# Altium project APES_Learn.PrjPcb
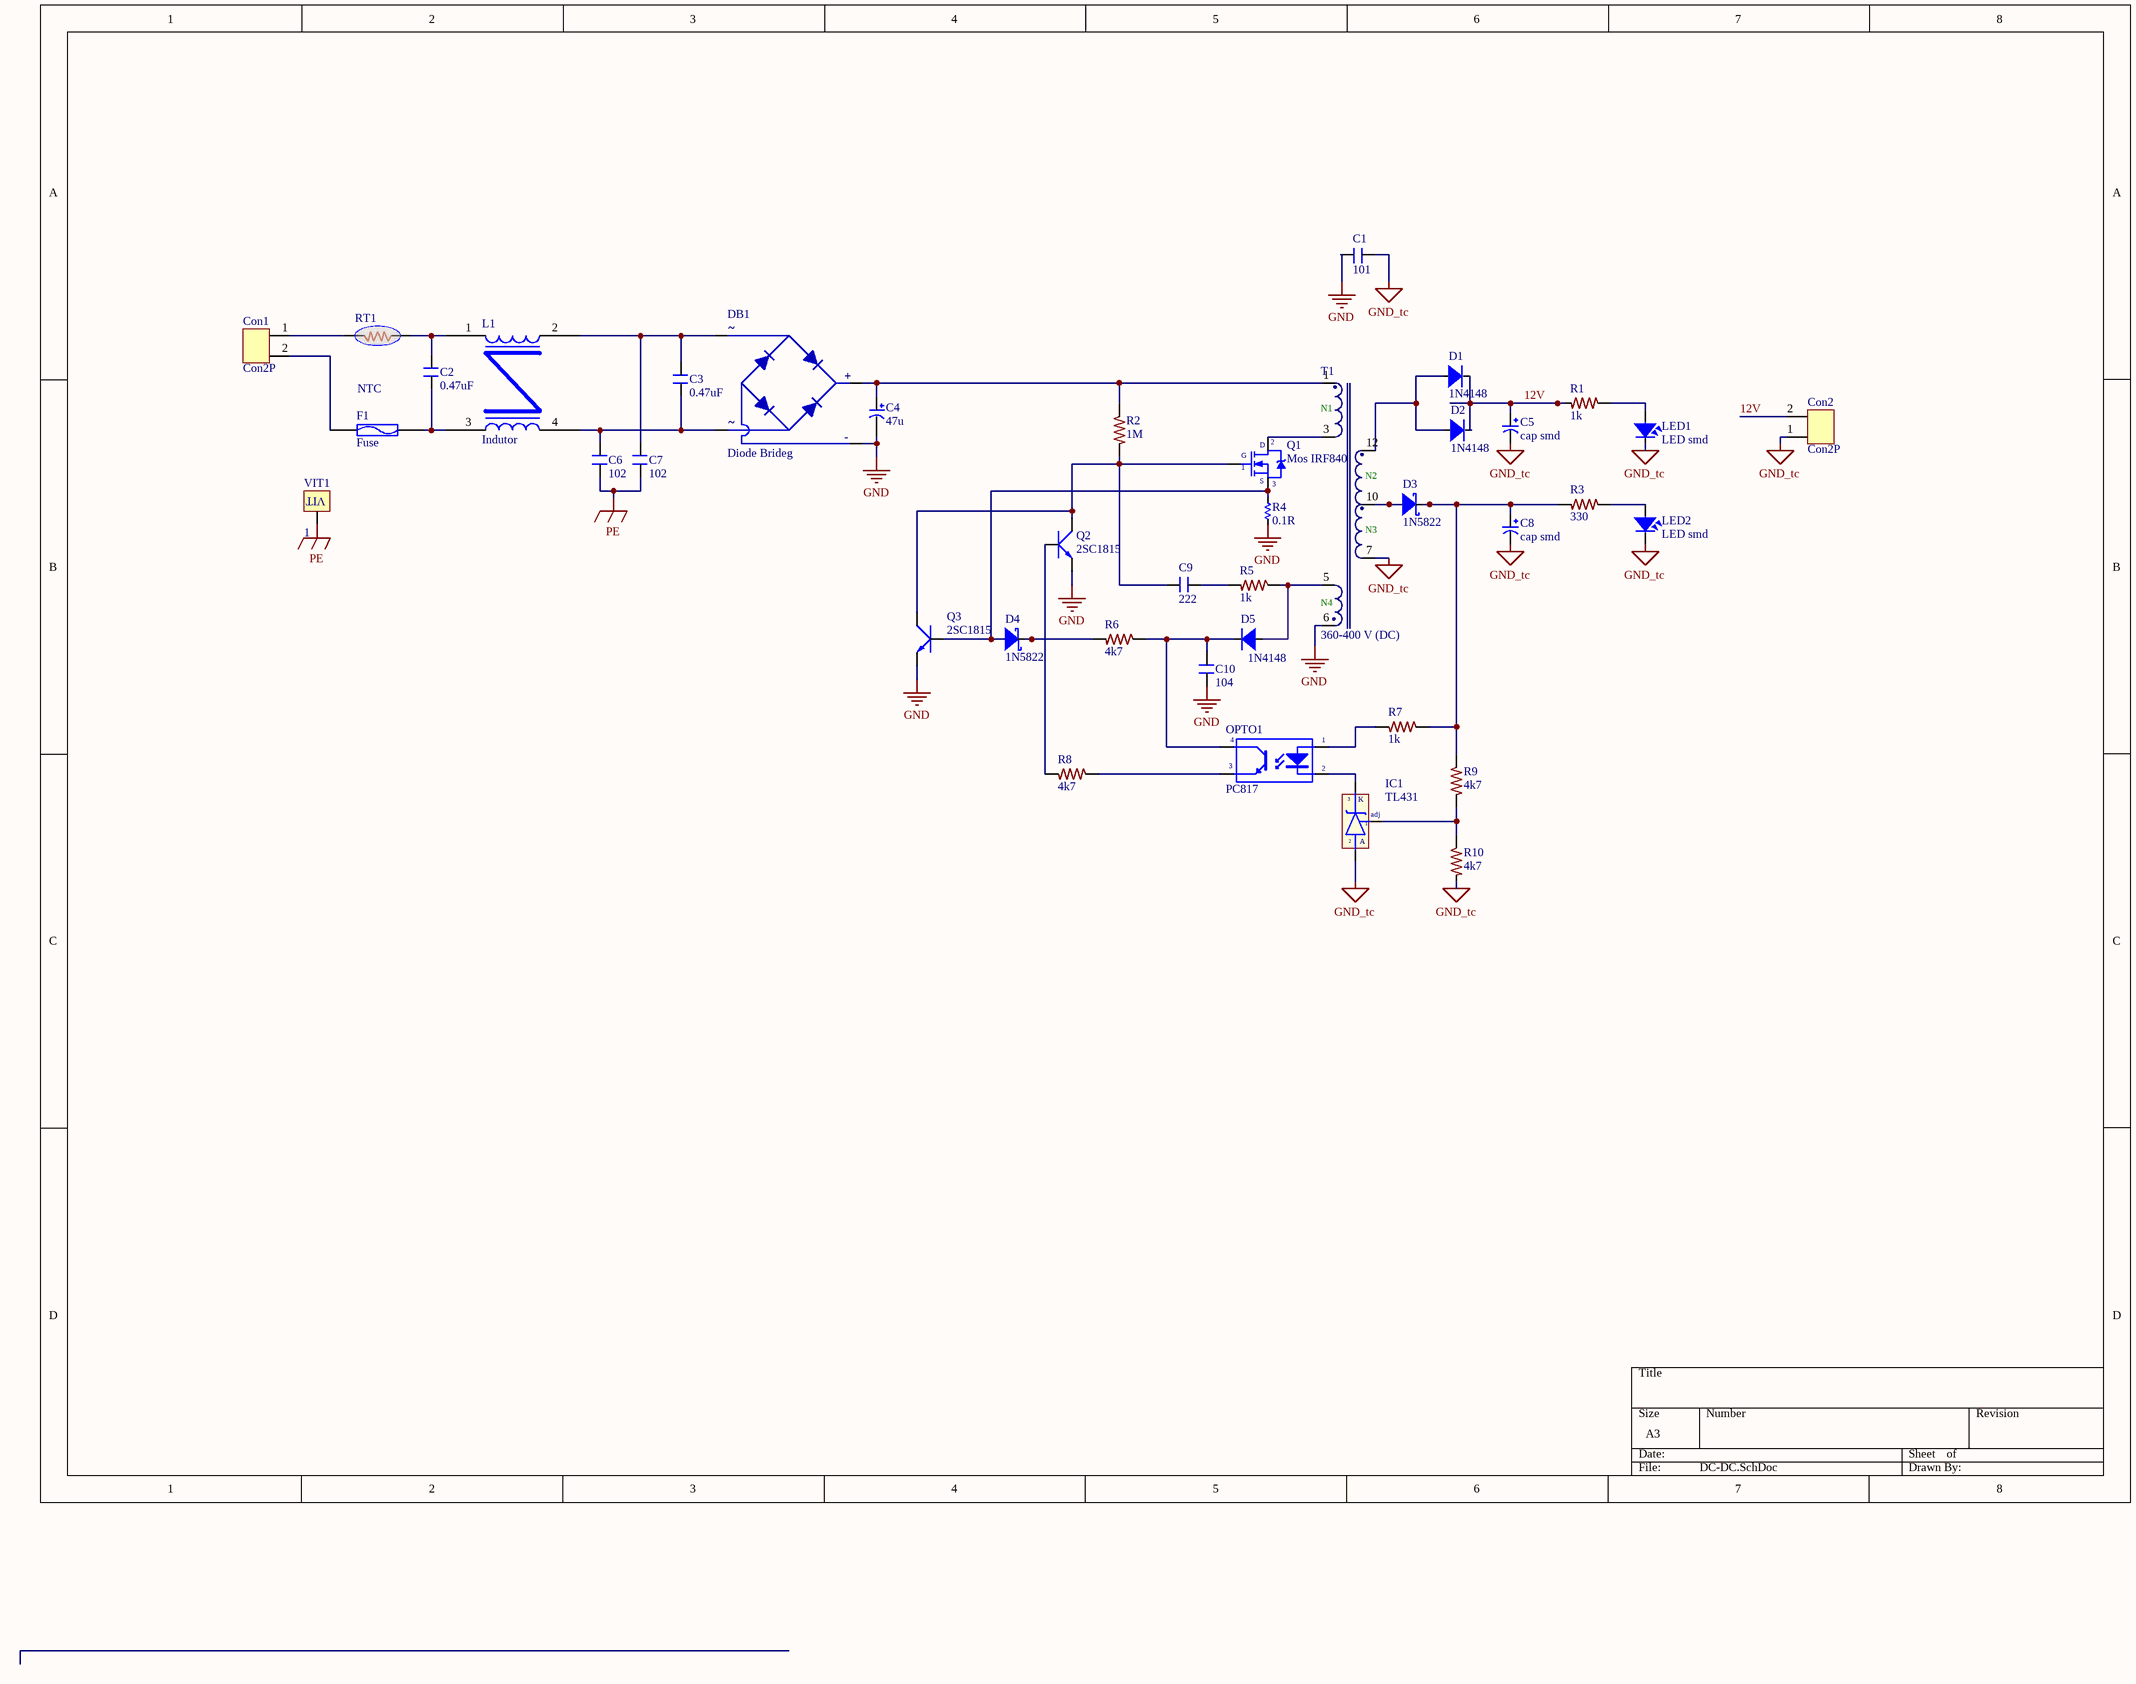
[diagram p0: DC-DC.SchDoc]
1 sheet, 40 parts. Net scope: global (net labels, ports and power ports of the same name join across sheets).
Board file: PCB1.PcbDoc

## Sheet DC-DC.SchDoc
size A3; SheetNumber: 1; SheetTotal: 1

### Parts
C1  101  [CN3]
C2  0.47uF  [CN3]
C3  0.47uF  [CN3]
C4  47u  [CP4/8.5]
C5  cap smd  [cap 13x14mm]
C6  102  [CN3]
C7  102  [CN3]
C8  cap smd  [cap 13x14mm]
C9  222  [cap 0603]
C10  104  [cap 0603]
Con1  Con2P  [connector2P]
Con2  Con2P  [connector2P]
D1  1N4148  [SOD123]
D2  1N4148  [SOD123]
D3  1N5822  [DO214 SMA]
D4  1N5822  [DO214 SMA]
D5  1N4148  [SOD123]
DB1  Diode Brideg  [DIO-Bri 5A]
F1  Fuse  [Fuse]
IC1  TL431  [TO92-123]
L1  Indutor  [UU9.8]
LED1  LED smd  [LED-0805-Yellow]
LED2  LED smd  [LED-0805-Yellow]
OPTO1  PC817  [PC817 smd]
Q1  Mos IRF840  [TO220H1]
Q2  2SC1815  [TO92-123]
Q3  2SC1815  [TO92-123]
R1  1k  [RES-SMD-2512]
R2  1M  [RES-SMD-2512]
R3  330  [RES-SMD-2512]
R4  0.1R  [RES-1/2W]
R5  1k  [RES-SMD-2512]
R6  4k7  [RES-SMD-2512]
R7  1k  [RES-SMD-2512]
R8  4k7  [RES-SMD-2512]
R9  4k7  [RES-SMD-2512]
R10  4k7  [RES-SMD-2512]
RT1  NTC  [NTC D13]
T1  360-400 V (DC)  [ETD34]
VIT1  1  [VIT]

### Nets
GND: C1.2 C4.2 C10.1 DB1.4(-V_OUT) Q2.1(E) Q3.1(E) R4.2 T1.6
GND_tc: C1.1 C5.2 C8.2 Con2.1 IC1.2(A) LED1.2 LED2.2 R10.2 T1.7
PE: C6.1 C7.1 VIT1.VIT1
12V: C5.1 Con2.2 D1.K D2.K R1.2
NetC2_1: C2.1 F1.2 L1.3
NetC2_2: C2.2 L1.1 RT1.2
NetC3_1: C3.1 C6.2 DB1.3(AC2) L1.4
NetC3_2: C3.2 C7.2 DB1.2(AC1) L1.2
NetC4_1: C4.1 DB1.1(+V_OUT) R2.1 T1.1
NetC8_1: C8.1 D3.K R3.2 R7.1 R9.1
NetC9_1: C9.1 Q1.1(G) Q2.2(C) Q3.2(C) R2.2
NetC9_2: C9.2 R5.2
NetC10_2: C10.2 D5.K OPTO1.4(C) R6.1
NetCon1_1: Con1.1 RT1.1
NetCon1_2: Con1.2 F1.1
NetD1_A: D1.A D2.A T1.12
NetD3_A: D3.A T1.10
NetD4_A: D4.A Q1.3(S) Q3.3(B) R4.1
NetD4_K: D4.K R6.2
NetD5_A: D5.A R5.1 T1.5
NetIC1_1: IC1.1(adj) R9.2 R10.1
NetIC1_3: IC1.3(K) OPTO1.2(K)
NetLED1_1: LED1.1 R1.1
NetLED2_1: LED2.1 R3.1
NetOPTO1_1: OPTO1.1(A) R7.2
NetOPTO1_3: OPTO1.3(E) R8.1
NetQ1_2: Q1.2(D) T1.3
NetQ2_3: Q2.3(B) R8.2

### Notes on the sheet
- (in symbol DIODE BRIGDE) ~; +; -
- (in symbol Tranf2) N1; N2; N3; N4
- (in symbol VIT_1) VIT

### Library data of the parts
C1-C3 C6 C7 C9 C10 = Cap: 0.47uF/1.6kV
C4 = Cap_electric: cap
C5 C8 = Cap_smd
Con1 Con2 = connector2P
D1 D2 D5 = Diode 1N4148
D3 D4 = Diode 1N5822: SS34 1N5822; Vrrm: 40V; If(rms): 10A; If(av): 3A
DB1 = DIODE BRIGDE: Convert AC to DC voltage, 4 pin; Value: Cau 1A
IC1 = TL431_1: Programmable Shunt Regulator; Value: TL431
L1 = Inductor UU9.8: UU9.8
Q1 = IRF840: MOSFET N - CHANNEL 500V - 0.75 - 8A - TO-220; Value: IRF840; VDS: 500V; ID: 8A
Q2 Q3 = 2SC1815: NPN 600mW, ECB; Value: C1815
R1-R3 R5-R10 = RES SMD
R4 = Res_1: Res; Manufacturer: Generic Components; Class: Passive; SubClass: R; Published: 08/06/2000; Publisher: Altium Hobart Technology Centre
RT1 = RT
T1 = Tranf2: Resonant Converter WE-LLCR, Ui=360-400 V (DC); PartNo: 760895441; Manufacturer: Würth Elektronik eiSos GmbH; OutPut Voltage: 24 V; Output Current: 6.2A; (Input Voltage) Ui: 360-400 V (DC); ComponentLink1Description: Manufacturer; ComponentLink1URL: http://www.we-online.de; Created by: Otto Christin; Created Date: NOV 2013; ComponentLink2Description: Datasheet; ComponentLink2URL: http://katalog.we-online.de/pbs/datasheet/760895441.pdf
VIT1 = VIT_1: Oc Vit